# EAGLE schematic marquee_h (EAGLE 9.3.0)
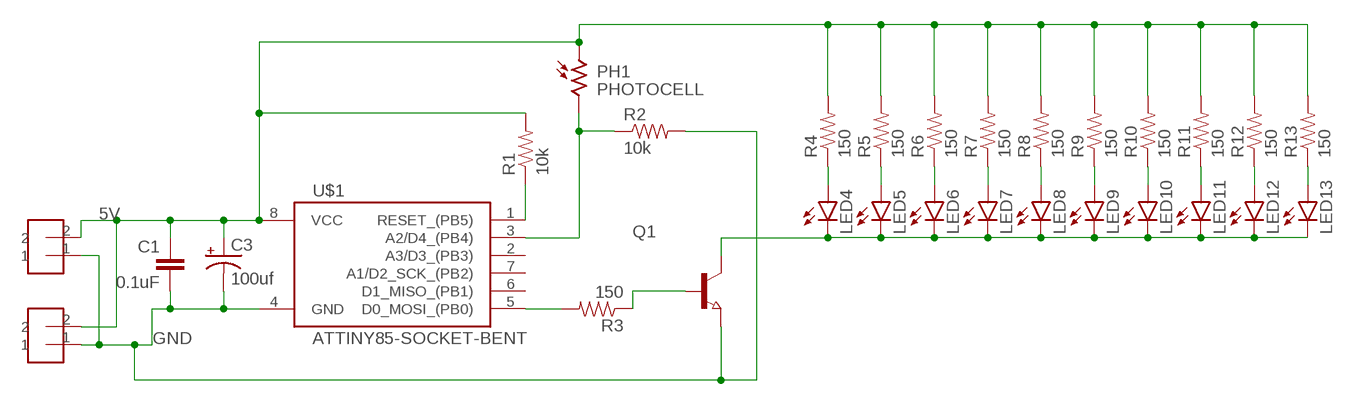
[diagram p0: schematic, sheet 1]

## Parts
C1  0.1uF  CAP-0805  [0805]
C3  100uf  CAP_POLD  [PANASONIC_D]
LED4  LED0603  [LED-0603]
LED5  LED0603  [LED-0603]
LED6  LED0603  [LED-0603]
LED7  LED0603  [LED-0603]
LED8  LED0603  [LED-0603]
LED9  LED0603  [LED-0603]
LED10  LED0603  [LED-0603]
LED11  LED0603  [LED-0603]
LED12  LED0603  [LED-0603]
LED13  LED0603  [LED-0603]
PH1  PHOTOCELL  [PHOTOCELL_ADAFRUIT]
Q1  TRANSISTOR-NPN-SOT23  [SOT23]
R1  10k  RESISTOR-0805  [0805]
R2  10k  RESISTOR-0805  [0805]
R3  150  RESISTOR-0805  [0805]
R4  150  RESISTOR0603  [0603-RES]
R5  150  RESISTOR0603  [0603-RES]
R6  150  RESISTOR0603  [0603-RES]
R7  150  RESISTOR0603  [0603-RES]
R8  150  RESISTOR0603  [0603-RES]
R9  150  RESISTOR0603  [0603-RES]
R10  150  RESISTOR0603  [0603-RES]
R11  150  RESISTOR0603  [0603-RES]
R12  150  RESISTOR0603  [0603-RES]
R13  150  RESISTOR0603  [0603-RES]
U$1  ATTINY85-SOCKET-BENT  [SOCKET-8PIN-BENT]
U$2  HEADER-2  [HEADER-2]
U$3  HEADER-2  [HEADER-2]

## Nets
5V: C1.1 C3.+ PH1.1 R1.2 R4.2 R5.2 R6.2 R7.2 R8.2 R9.2 R10.2 R11.2 R12.2 R13.2 U$1.8(VCC) U$2.2 U$3.2
GND: C1.2 C3.- Q1.2(E) R2.2 U$1.4(GND) U$2.1 U$3.1
GND_LED: LED4.C LED5.C LED6.C LED7.C LED8.C LED9.C LED10.C LED11.C LED12.C LED13.C Q1.3(C)
N$1: LED4.A R4.1
N$2: Q1.1(B) R3.1
N$3: R3.2 U$1.5(D0_MOSI_(PB0))
N$7: LED5.A R5.1
N$8: LED6.A R6.1
N$9: LED7.A R7.1
N$10: LED8.A R8.1
N$11: LED9.A R9.1
N$12: LED10.A R10.1
N$13: LED11.A R11.1
N$14: LED12.A R12.1
N$15: LED13.A R13.1
RESET: R1.1 U$1.1(RESET_(PB5))
SENSOR: PH1.2 R2.1 U$1.3(A2/D4_(PB4))
Unconnected: U$1.2(A3/D3_(PB3)) U$1.6(D1_MISO_(PB1)) U$1.7(A1/D2_SCK_(PB2))

## Library data of the parts
C1 = homemade-hardware:CAP: Capacitor Standard 0603 ceramic capacitor, and 0.1" leaded capacitor.
C3 = homemade-hardware:CAP_POL: Capacitor Polarized These are standard SMD and PTH capacitors. Normally 10uF, 47uF, and 100uF in electrolytic and tantalum varieties. Always verify the external diameter of the through hole cap, it varies with capacity, voltage, and manufacturer. The EIA devices should be standard.
LED4-LED13 = homemade-hardware:LED: LEDs Standard schematic elements and footprints for 5mm, 3mm, 1206, and 0603 sized LEDs. 5mm - Spark Fun Electronics SKU : COM-00529 (and others)
PH1 = homemade-hardware:PHOTOCELL: 161 (Adafruit) <https://www.digikey.com/product-detail/en/adafruit-industries-llc/161/1528-2141-ND/7244927?utm_adgroup=Sensors%20&%20Transducers>: 200k Ohm photocell
Q1 = homemade-hardware:TRANSISTOR-NPN: NPN Transistor BJT <https://www.digikey.com/product-detail/en/micro-commercial-co/MMBT2222A-TP/MMBT2222ATPMSCT-ND/717394>: MMBT2222A
R1-R13 = homemade-hardware:RESISTOR: Resistor Basic schematic elements and footprints for 0603, 1206, and PTH resistors.
U$1 = homemade-hardware:ATTINY85
U$2 U$3 = homemade-hardware:HEADER-2